# EAGLE schematic master_controller (EAGLE 4.16)
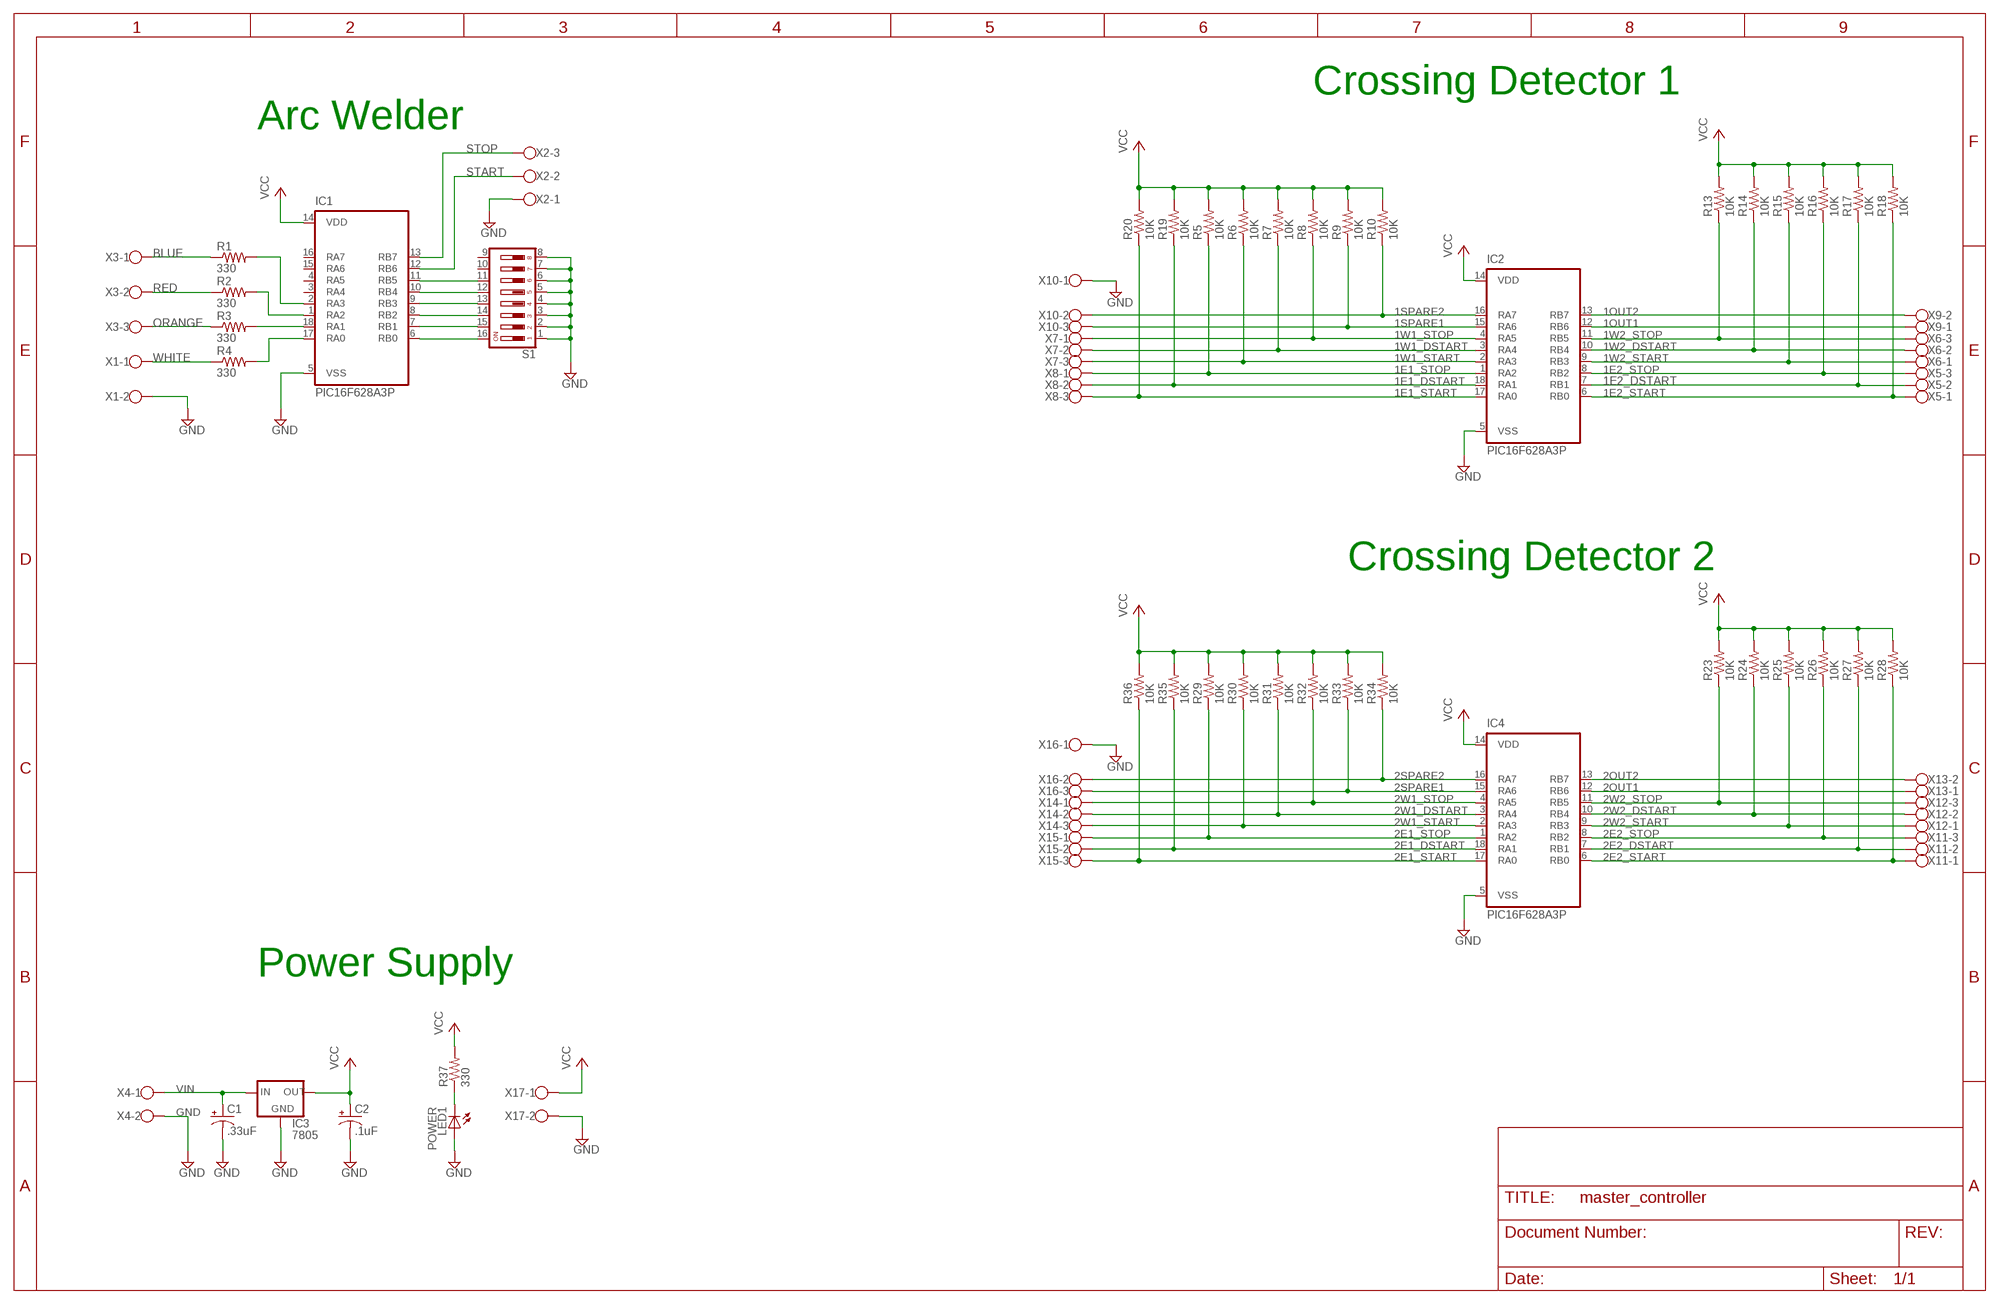
[diagram p0: schematic, sheet 1]

## Parts
C1  .33uF  CPOL-USE2-5  [E2-5]
C2  .1uF  CPOL-USE2-5  [E2-5]
IC1  PIC16F628A3P  [DIL18]
IC2  PIC16F628A3P  [DIL18]
IC3  7805  78XXS  [78XXS]
IC4  PIC16F628A3P  [DIL18]
LED1  POWER  LED5MM  [LED5MM]
R1  330  R-US_0207/10  [0207/10]
R2  330  R-US_0207/10  [0207/10]
R3  330  R-US_0207/10  [0207/10]
R4  330  R-US_0207/10  [0207/10]
R5  10K  R-US_0207/10  [0207/10]
R6  10K  R-US_0207/10  [0207/10]
R7  10K  R-US_0207/10  [0207/10]
R8  10K  R-US_0207/10  [0207/10]
R9  10K  R-US_0207/10  [0207/10]
R10  10K  R-US_0207/10  [0207/10]
R13  10K  R-US_0207/10  [0207/10]
R14  10K  R-US_0207/10  [0207/10]
R15  10K  R-US_0207/10  [0207/10]
R16  10K  R-US_0207/10  [0207/10]
R17  10K  R-US_0207/10  [0207/10]
R18  10K  R-US_0207/10  [0207/10]
R19  10K  R-US_0207/10  [0207/10]
R20  10K  R-US_0207/10  [0207/10]
R23  10K  R-US_0207/10  [0207/10]
R24  10K  R-US_0207/10  [0207/10]
R25  10K  R-US_0207/10  [0207/10]
R26  10K  R-US_0207/10  [0207/10]
R27  10K  R-US_0207/10  [0207/10]
R28  10K  R-US_0207/10  [0207/10]
R29  10K  R-US_0207/10  [0207/10]
R30  10K  R-US_0207/10  [0207/10]
R31  10K  R-US_0207/10  [0207/10]
R32  10K  R-US_0207/10  [0207/10]
R33  10K  R-US_0207/10  [0207/10]
R34  10K  R-US_0207/10  [0207/10]
R35  10K  R-US_0207/10  [0207/10]
R36  10K  R-US_0207/10  [0207/10]
R37  330  R-US_0207/10  [0207/10]
S1  DS08  [DS-08]
X1  AK500/2  [AK500/2]
X2  AK500/3  [AK500/3]
X3  AK500/3  [AK500/3]
X4  AK500/2  [AK500/2]
X5  AK500/3  [AK500/3]
X6  AK500/3  [AK500/3]
X7  AK500/3  [AK500/3]
X8  AK500/3  [AK500/3]
X9  AK500/2  [AK500/2]
X10  AK500/3  [AK500/3]
X11  AK500/3  [AK500/3]
X12  AK500/3  [AK500/3]
X13  AK500/2  [AK500/2]
X14  AK500/3  [AK500/3]
X15  AK500/3  [AK500/3]
X16  AK500/3  [AK500/3]
X17  AK500/2  [AK500/2]

## Nets
1E1_DSTART: IC2.18(RA1) R19.1 X8.2
1E1_START: IC2.17(RA0) R20.1 X8.3
1E1_STOP: IC2.1(RA2) R5.1 X8.1
1E2_DSTART: IC2.7(RB1) R17.1 X5.2
1E2_START: IC2.6(RB0) R18.1 X5.1
1E2_STOP: IC2.8(RB2) R16.1 X5.3
1OUT1: IC2.12(RB6) X9.1
1OUT2: IC2.13(RB7) X9.2
1SPARE1: IC2.15(RA6) R9.1 X10.3
1SPARE2: IC2.16(RA7) R10.1 X10.2
1W1_DSTART: IC2.3(RA4) R7.1 X7.2
1W1_START: IC2.2(RA3) R6.1 X7.3
1W1_STOP: IC2.4(RA5) R8.1 X7.1
1W2_DSTART: IC2.10(RB4) R14.1 X6.2
1W2_START: IC2.9(RB3) R15.1 X6.1
1W2_STOP: IC2.11(RB5) R13.1 X6.3
2E1_DSTART: IC4.18(RA1) R35.1 X15.2
2E1_START: IC4.17(RA0) R36.1 X15.3
2E1_STOP: IC4.1(RA2) R29.1 X15.1
2E2_DSTART: IC4.7(RB1) R27.1 X11.2
2E2_START: IC4.6(RB0) R28.1 X11.1
2E2_STOP: IC4.8(RB2) R26.1 X11.3
2OUT1: IC4.12(RB6) X13.1
2OUT2: IC4.13(RB7) X13.2
2SPARE1: IC4.15(RA6) R33.1 X16.3
2SPARE2: IC4.16(RA7) R34.1 X16.2
2W1_DSTART: IC4.3(RA4) R31.1 X14.2
2W1_START: IC4.2(RA3) R30.1 X14.3
2W1_STOP: IC4.4(RA5) R32.1 X14.1
2W2_DSTART: IC4.10(RB4) R24.1 X12.2
2W2_START: IC4.9(RB3) R25.1 X12.1
2W2_STOP: IC4.11(RB5) R23.1 X12.3
BLUE: R1.1 X3.1
GND: C1.- C2.- IC1.5(VSS) IC2.5(VSS) IC3.GND IC4.5(VSS) LED1.A S1.1 S1.2 S1.3 S1.4 S1.5 S1.6 S1.7 S1.8 X1.2 X2.1 X4.2 X10.1 X16.1 X17.2
N$1: IC1.2(RA3) R1.2
N$2: IC1.1(RA2) R2.2
N$3: IC1.18(RA1) R3.2
N$4: IC1.17(RA0) R4.2
N$5: LED1.K(C) R37.1
N$9: IC1.11(RB5) S1.11
N$12: IC1.6(RB0) S1.16
N$13: IC1.7(RB1) S1.15
N$14: IC1.8(RB2) S1.14
N$15: IC1.9(RB3) S1.13
N$16: IC1.10(RB4) S1.12
ORANGE: R3.1 X3.3
RED: R2.1 X3.2
START: IC1.12(RB6) X2.2
STOP: IC1.13(RB7) X2.3
VCC: C2.+ IC1.14(VDD) IC2.14(VDD) IC3.OUT IC4.14(VDD) R5.2 R6.2 R7.2 R8.2 R9.2 R10.2 R13.2 R14.2 R15.2 R16.2 R17.2 R18.2 R19.2 R20.2 R23.2 R24.2 R25.2 R26.2 R27.2 R28.2 R29.2 R30.2 R31.2 R32.2 R33.2 R34.2 R35.2 R36.2 R37.2 X17.1
VIN: C1.+ IC3.IN X4.1
WHITE: R4.1 X1.1
Unconnected: IC1.3(RA4) IC1.4(RA5) IC1.15(RA6) IC1.16(RA7) S1.9 S1.10

## Notes on the sheet
- Crossing Detector 1
- Arc Welder
- Crossing Detector 2
- Power Supply

## Library data of the parts
C1 C2 = rcl:CPOL-US: POLARIZED CAPACITOR, American symbol
IC1 IC2 IC4 = microchip:PIC16F628A: MICROCONTROLLER 8-Bit PIC16F628 Family - CMOS Flash/EEPROM Pin Compatible : PIC16F83, PIC16CR83, PIC16F84A, PIC16CR84 see also PIC16C*
IC3 = v-reg:78XXS: VOLTAGE REGULATOR
LED1 = led:LED: LED OSRAM: - CHIPLED LG R971, LG N971, LY N971, LG Q971, LY Q971, LO R971, LY R971 LH N974, LH R974 LS Q976, LO Q976, LY Q976 LO Q996 - Hyper CHIPLED LW Q18S LB Q993, LB Q99A, LB R99A - SideLED LS A670, LO A670, LY A670, LG A670, LP A670 LB A673, LV A673, LT A673, LW A673 LH A674 LY A675 LS A676, LA A676, LO A676, LY A676, LW A676 LS A679, LY A679, LG A679 - Hyper Micro SIDELED® LS Y876, LA Y876, LO Y876, LY Y876 LT Y87S - SmartLED LW L88C, LW L88S LB L89C, LB L89S, LG L890 LS L89K, LO L89K, LY L89K LS L896, LA L896, LO L896, LY L896 - TOPLED LS T670, LO T670, LY T670, LG T670, LP T670 LSG T670, LSP T670, LSY T670, LOP T670, LYG T670 LG T671, LOG T671, LSG T671 LB T673, LV T673, LT T673, LW T673 LH T674 LS T676, LA T676, LO T676, LY T676, LB T676, LH T676, LSB T676, LW T676 LB T67C, LV T67C, LT T67C, LS T67K, LO T67K, LY T67K, LW E67C LS E67B, LA E67B, LO E67B, LY E67B, LB E67C, LV E67C, LT E67C LW T67C LS T679, LY T679, LG T679 LS T770, LO T770, LY T770, LG T770, LP T770 LB T773, LV T773, LT T773, LW T773 LH T774 LS E675, LA E675, LY E675, LS T675 LS T776, LA T776, LO T776, LY T776, LB T776 LHGB T686 LT T68C, LB T68C - Hyper Mini TOPLED® LB M676 - Mini TOPLED Santana® LG M470 LS M47K, LO M47K, LY M47K Source: http://www.osram.convergy.de - LUMILED® LXK2-PW12-R00, LXK2-PW12-S00, LXK2-PW14-U00, LXK2-PW14-V00 LXK2-PM12-R00, LXK2-PM12-S00, LXK2-PM14-U00 LXK2-PE12-Q00, LXK2-PE12-R00, LXK2-PE12-S00, LXK2-PE14-T00, LXK2-PE14-U00 LXK2-PB12-K00, LXK2-PB12-L00, LXK2-PB12-M00, LXK2-PB14-N00, LXK2-PB14-P00, LXK2-PB14-Q00 LXK2-PR12-L00, LXK2-PR12-M00, LXK2-PR14-Q00, LXK2-PR14-R00 LXK2-PD12-Q00, LXK2-PD12-R00, LXK2-PD12-S00 LXK2-PH12-R00, LXK2-PH12-S00 LXK2-PL12-P00, LXK2-PL12-Q00, LXK2-PL12-R00 Source: www.luxeon.com
R1-R10 R13-R20 R23-R37 = rcl:R-US_: RESISTOR, American symbol
S1 = switch-dil:DS08: DIL/CODE SWITCH
X1 X4 X9 X13 X17 = con-ptr500+:AK500/2: CONNECTOR
X2 X3 X5-X8 X10-X12 X14-X16 = con-ptr500+:AK500/3: CONNECTOR